# Altium schematic sheet Power Supply.SchDoc
size A3
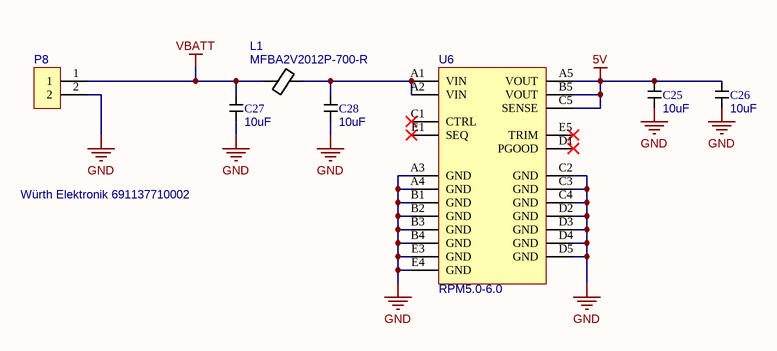
[diagram p0: Power Supply.SchDoc]

## Parts
?  (no value)
C25  Capacitance: 10uF  [C0805]  (hidden comment: F)
C26  Capacitance: 10uF  [C0805]  (hidden comment: F)
C27  Capacitance: 10uF  [C0805]  (hidden comment: F)
C28  Capacitance: 10uF  [C0805]  (hidden comment: F)
L1  MFBA2V2012P-700-R  [0805]
P8  Würth Elektronik 691137710002  [Würth Elektronik 691137710002]
U6  RPM5.0-6.0  [RPM5.0-6.0]

## Nets
5V: C25.1 C26.1 U6.A5(VOUT) U6.B5(VOUT) U6.C5(SENSE)
GND: C25.2 C26.2 C27.2 C28.2 P8.2 U6.A3(GND) U6.A4(GND) U6.B1(GND) U6.B2(GND) U6.B3(GND) U6.B4(GND) U6.C2(GND) U6.C3(GND) U6.C4(GND) U6.D2(GND) U6.D3(GND) U6.D4(GND) U6.D5(GND) U6.E3(GND) U6.E4(GND)
VBATT: C27.1 L1.1 P8.1
NetC28_1: C28.1 L1.2 U6.A1(VIN) U6.A2(VIN)

Not connected (* = marked no-connect by the designer): U6 C1(CTRL)* D1(PGOOD)* E1(SEQ)* E5(TRIM)*

## Notes on the sheet
- DRAWN BY
- CHECKED BY
- DATE
- TITLE
- Title
- Size:
- Date:
- A3
- Number:
- Time:
- Revision:
- Sheet
- of
- APPROVED BY
- RELEASED BY
- SCALE:
- SIZE
- DRAWING NUMBER
- SHEET
- -
- OF
- File:

## Library data of the parts
? = Title Block
C25-C28 = Capacitor: Manufacturer: Murata Electronics; Manufacturer Part Number: GRM21BZ71E106KE15L; Voltage Rating: 25V; Supplier: Digi-Key Electronics; Supplier Part Number: 490-GRM21BZ71E106KE15LCT-ND; Price: 0.03
L1 = Ferrite Bead: Manufacturer: Eaton - Electronics Division; Impedance @ Frequency: 70 Ohms @ 100 MHz; Current Rating: 6A; Supplier: Digi-Key Electronics; Supplier Part Number: 283-MFBA2V2012P-700-RCT-ND; Manufacturer Part Number: MFBA2V2012P-700-R
P8 = Würth Elektronik 691137710002: 2 Position Wire to Board Terminal Block Horizontal with Board 0.197" (5.00mm) Through Hole; Positions: 2; Voltage Rating: 300V; Current Rating: 16A; Wire Gauge: 12-30AWG; Manufacturer: Würth Elektronik; Manufacturer Part Number: 691137710002; Supplier: Digi-Key Electronics; Supplier Part Number: 732-10955-ND
U6 = RPM5.0-6.0: Non-Isolated PoL Module DC DC Converter 1 Output 5V 6A 4V - 15V Input; Manufacturer: Recom Power; Voltage Input: 4 - 15V; Supplier: Digi-Key Electronics; Supplier Part Number: 945-RPM5.0-6.0CT-ND; Manufacturer Part Number: RPM5.0-6.0; Output Voltage: 5V; Output Current: 6A